# EAGLE design redbear (EAGLE 7.5.0)
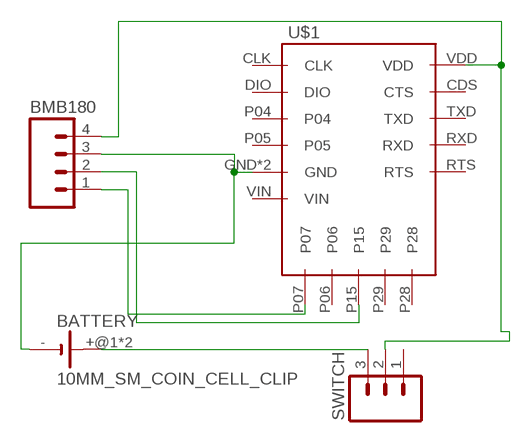
[diagram p0: schematic, sheet 1]

## Parts
BATTERY  10MM_SM_COIN_CELL_CLIP  [10MM_SM_COIN_CELL_CLIP]
BMB180  M04NO_SILK_ALL_ROUND  [1X04_NO_SILK_ALL_ROUND]
SWITCH  M03PTH  [1X03]
U$1  REDBEAR_NANOBREAKOUT1  [BREAKOUT]

## Nets
GND: BATTERY.- BMB180.3 U$1.GND U$1.GND1(GND)
N$1: BATTERY.+@1(+) BATTERY.+@2(+) SWITCH.3
SCL: BMB180.2 U$1.P15
SDA: BMB180.1 U$1.P07
VCC: BMB180.4 SWITCH.2 U$1.VDD
Unconnected: SWITCH.1 U$1.CDS(CTS) U$1.CLK U$1.DIO U$1.P04 U$1.P05 U$1.P06 U$1.P28 U$1.P29 U$1.RTS U$1.RXD U$1.TXD U$1.VIN

## Library data of the parts
BATTERY = battery:10MM_SM_COIN_CELL_CLIP: Battery cell clip for CR927 Source: KEYSTONE ELECTRONICS CORP. www.keyelco.com, ASTORIA, N.Y. 11105-2017 PART ANME 10mm SM COIN CELl CLIP DWG NO. 3030
BMB180 = SparkFun-Connectors:M04: Header 4 Standard 4-pin 0.1" header. Use with straight break away headers (SKU : PRT-00116), right angle break away headers (PRT-00553), swiss pins (PRT-00743), machine pins (PRT-00117), and female headers (PRT-00115). Molex polarized connector foot print use with SKU : PRT-08231 with associated crimp pins and housings. 1MM SMD Version SKU: PRT-10208; PROD_ID: CONN-09696
SWITCH = SparkFun-Connectors:M03: Header 3 Standard 3-pin 0.1" header. Use with straight break away headers (SKU : PRT-00116), right angle break away headers (PRT-00553), swiss pins (PRT-00743), machine pins (PRT-00117), and female headers (PRT-00115). Molex polarized connector foot print use with SKU : PRT-08232 with associated crimp pins and housings.
U$1 = redbear_nano:REDBEAR_NANO

## Board
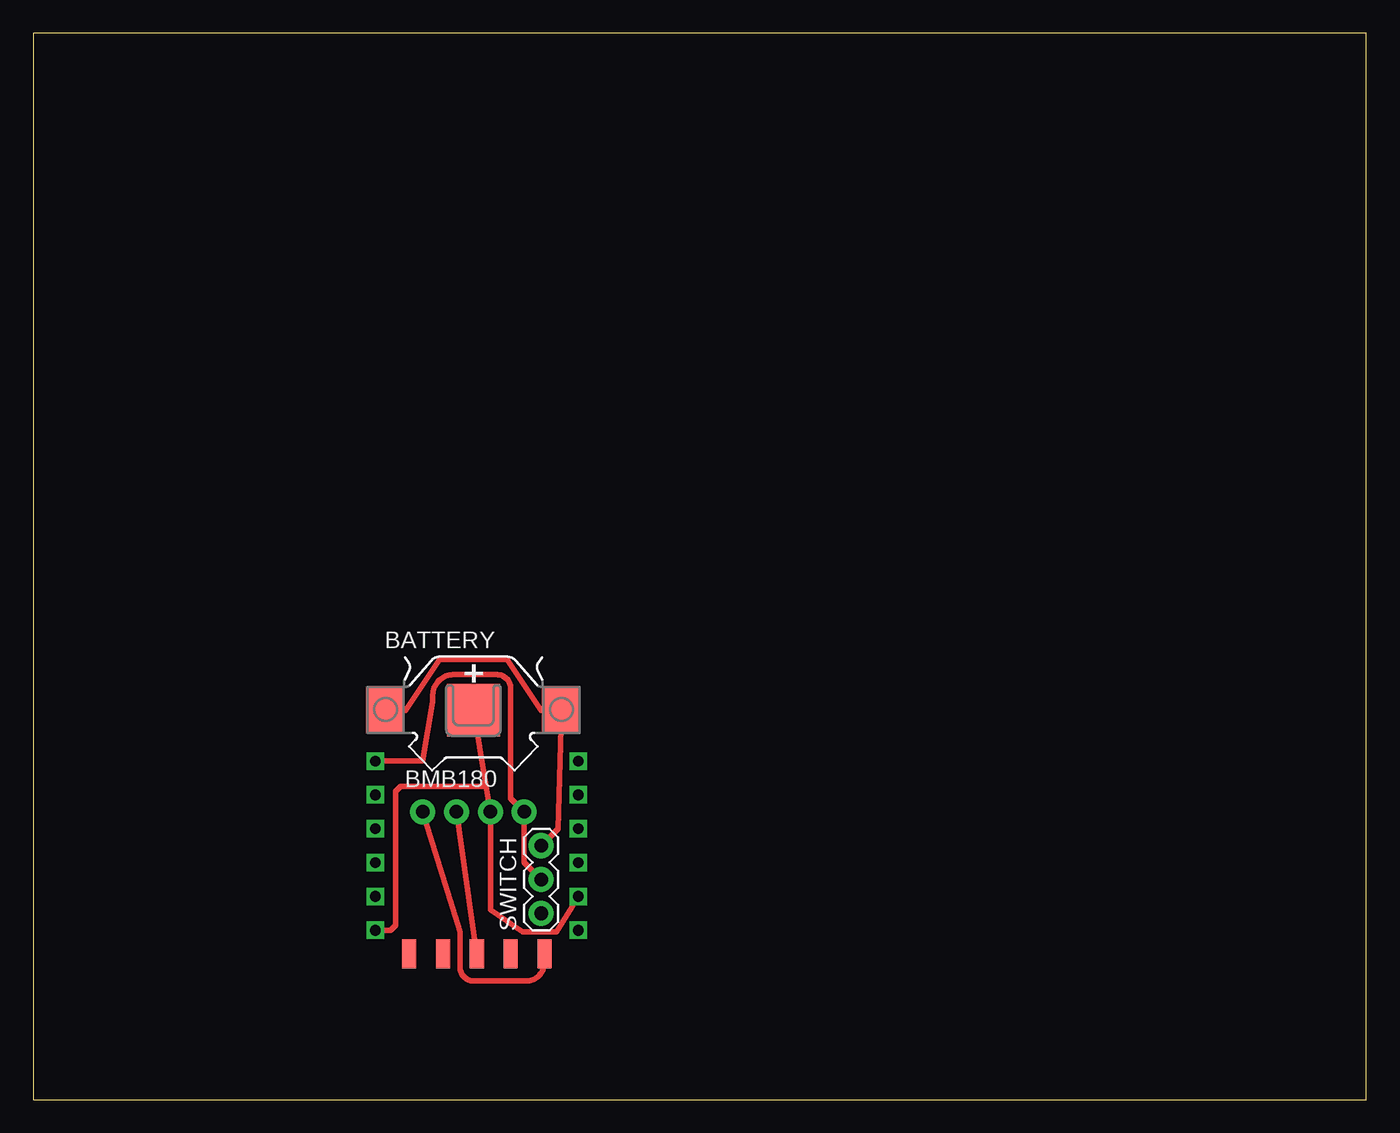
[diagram p1: board, top side]

Size 100 x 80 mm. Coordinates in mm from the lower left corner, seen from the top.
Outline: 0,0 100,0 100,80 0,80 0,0
Copper layers (1*16): Top 0.035mm / dielectric 1.5mm / Bottom 0.035mm
Design rules "default": minimum track width 10mil, minimum drill 24mil, track to track 8mil, track to pad 8mil, pad to pad 8mil, via to via 8mil, smd to smd 8mil, copper to edge 40mil, drill to drill 8mil, minimum pad ring 10mil, minimum via ring 8mil, stop-mask expansion 4mil, vias tented up to drill 0mil, thermal gap 10mil

### Footprints (pad centres in the part's own frame; a part is rotated, then mirrored left to right if it is on the bottom)
10MM_SM_COIN_CELL_CLIP = smd 2.9 x 3.5: +@1 -6.6,0; +@2 6.6,0 | smd 3.96 x 3.96: - 0,0
1X04_NO_SILK_ALL_ROUND = drill 1.016 pad 1.88: 1 0,0; 2 2.54,0; 3 5.08,0; 4 7.62,0
1X03 = drill 1.016 pad 1.88: 1 0,0; 2 2.54,0; 3 5.08,0
BREAKOUT = drill 0.8 square: CDS -2.286,7.62; CLK 12.954,10.16; DIO 12.954,7.62; GND -2.286,-2.54; GND1 12.954,0; P04 12.954,5.08; P05 12.954,2.54; RTS -2.286,0; RXD -2.286,2.54; TXD -2.286,5.08; VDD -2.286,10.16; VIN 12.954,-2.54 | smd 1.067 x 2.184: P06 7.874,-4.318; P07 10.414,-4.318; P15 5.334,-4.318; P28 0.254,-4.318; P29 2.794,-4.318

### Placement (x,y rotation side)
BATTERY  33.02,29.21 0 top
BMB180  29.21,21.59 0 top
SWITCH  38.1,13.97 90 top
U$1  27.94,15.24 0 top

### Tracks (layer width: path | path; a pad name or v marks a point on that pad's centre or on a via)
GND
  Top 0.406: BATTERY.- 33.94,23.71 | 33.94,23.71 34.08,22.83 BMB180.3 34.29,14.22 36.7,12.57 39.24,12.57 U$1.GND1 | U$1.GND 26.8,12.7 27.18,13.08 27.18,23.11 27.56,23.5 33.72,23.5 33.94,23.71
N$1
  Top 0.406: BATTERY.+@1 27.94,29.21 30.48,33.02 35.56,33.02 38.1,29.21 BATTERY.+@2 39.37,20.32 SWITCH.3
SCL
  Top 0.406: BMB180.2 U$1.P15
SDA
  Top 0.406: BMB180.1 32,12.57 32,10.03 arc90 33.02,8.89 36.96,8.89 arc90 38.35,10.29 U$1.P07
VCC
  Top 0.406: SWITCH.2 36.83,17.78 BMB180.4 35.81,22.61 35.81,30.86 arc90 34.8,31.88 31.5,31.88 arc90 29.97,30.35 29.97,29.84 29.21,25.4 U$1.VDD